# Altium project Altium PCB Template.PrjPCB
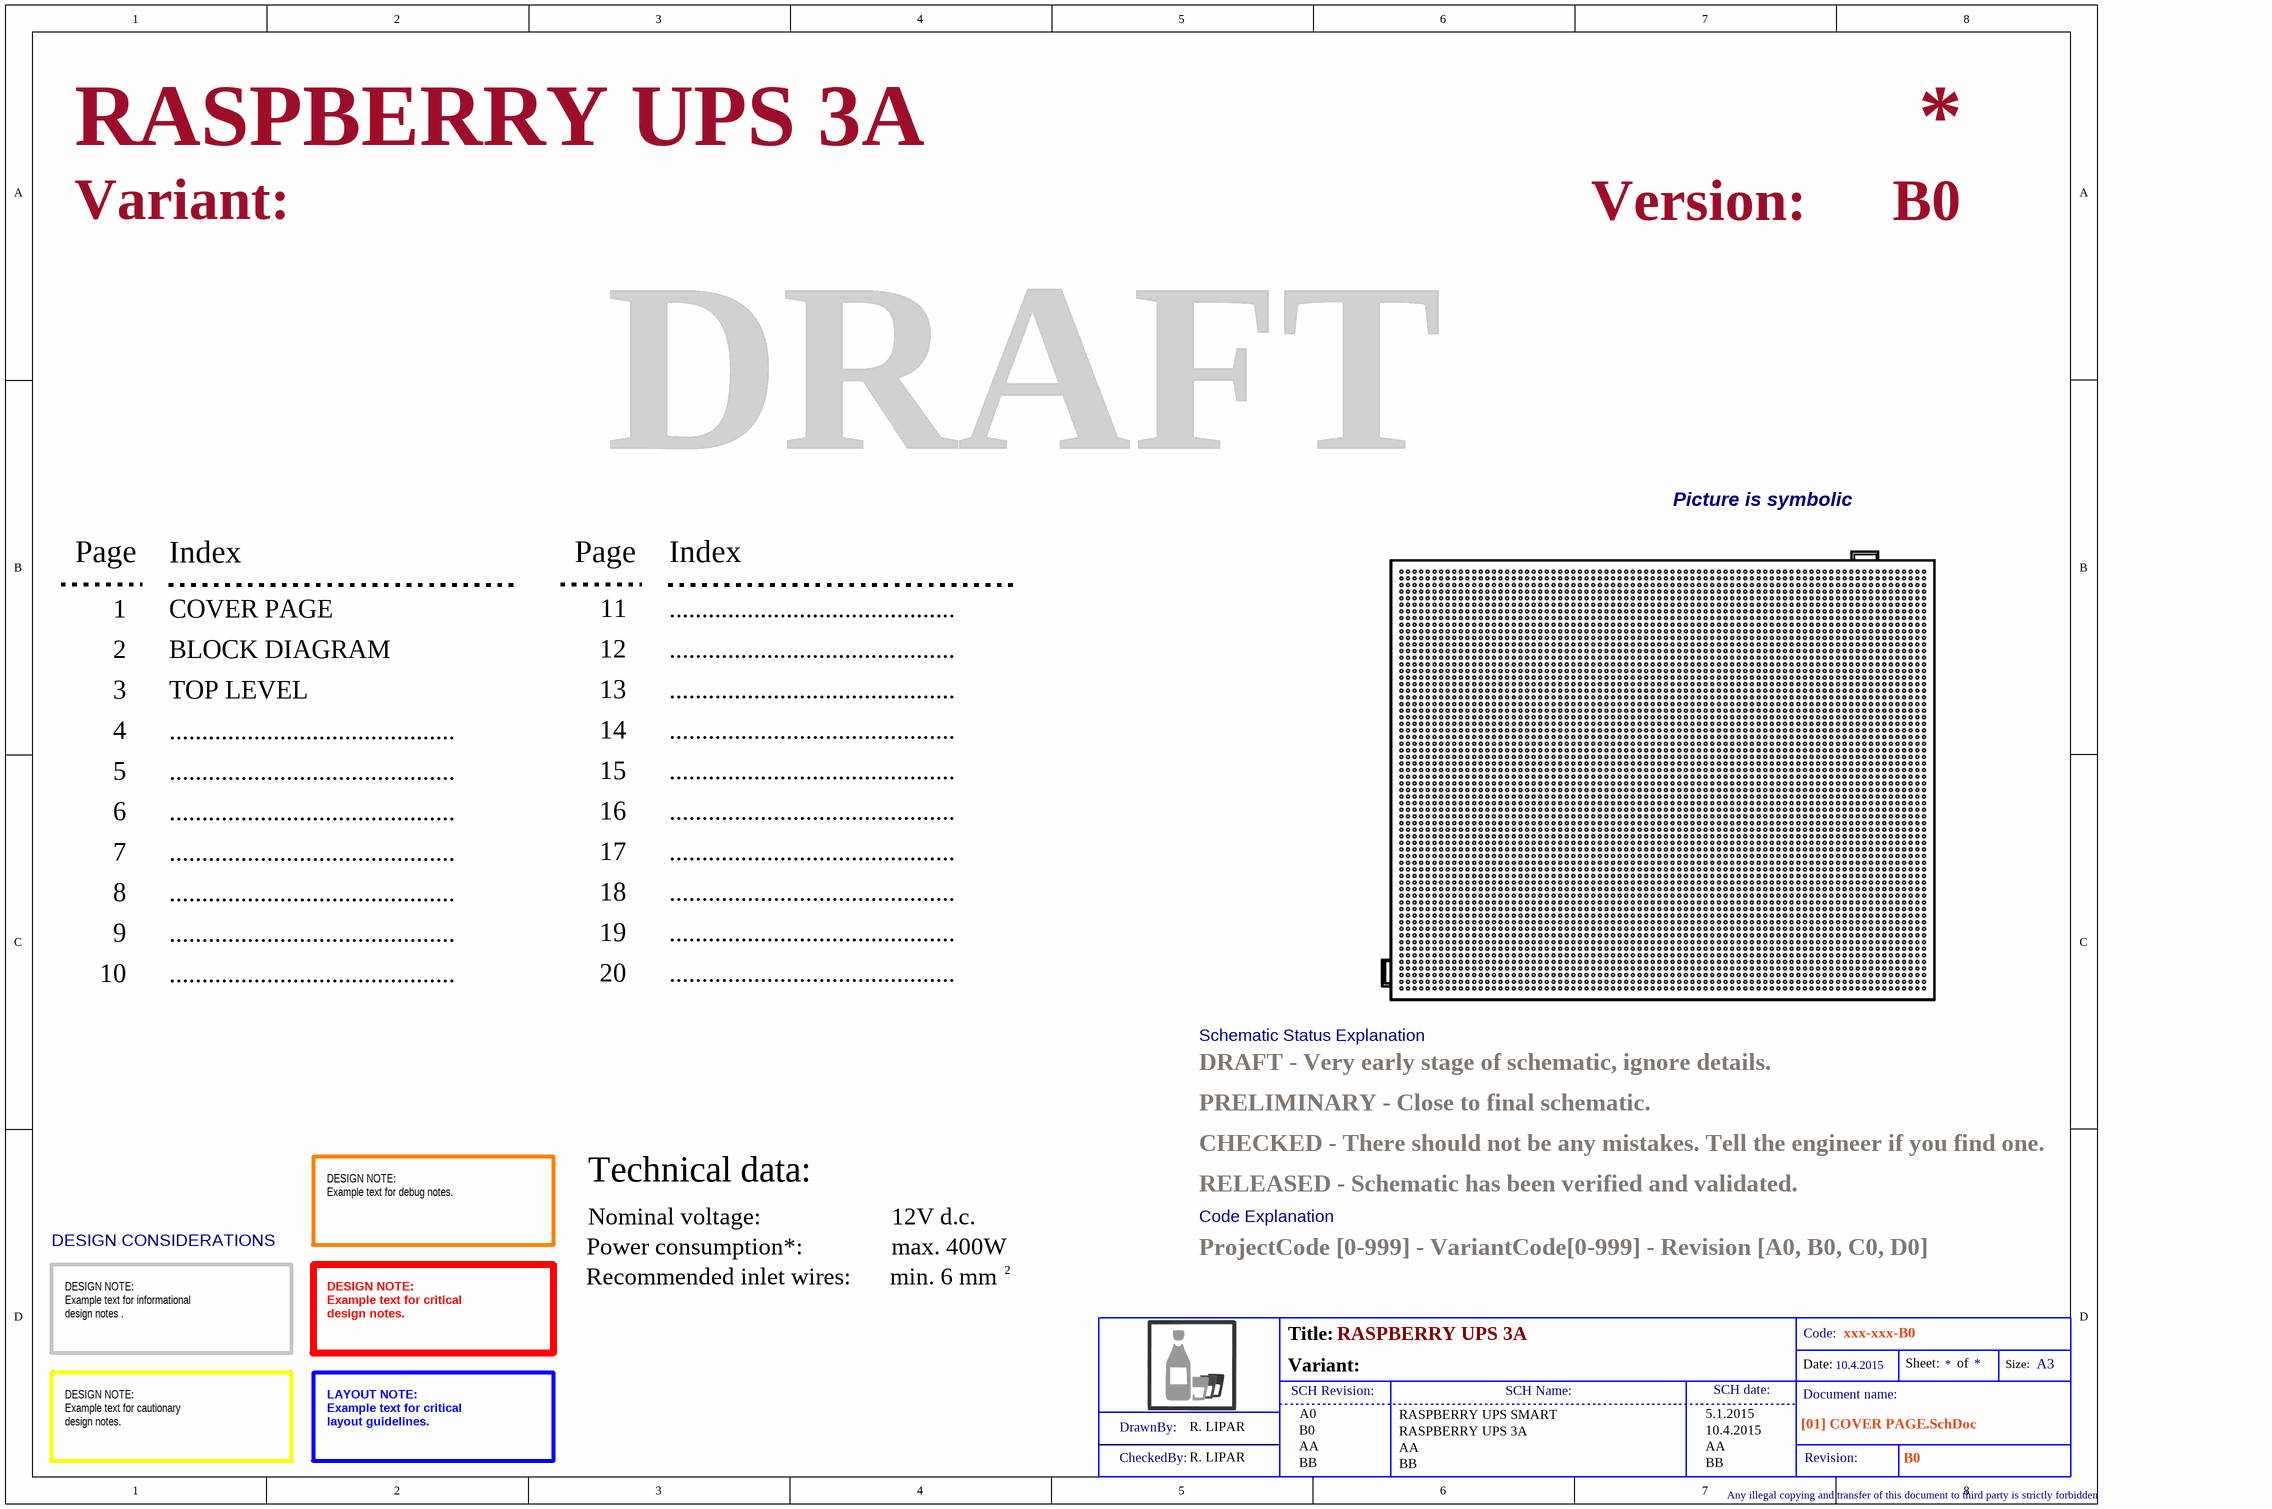
[diagram p0: [01] COVER PAGE.SchDoc]
SCHRevision: B0; SCHDate: 10.4.2015; SCHCode: xxx-xxx-B0; SCH3VERSION: BB; SCH3NAME: BB; SCH3DATE: BB; SCH2VERSION: AA; SCH2NAME: AA; SCH2DATE: AA; SCH1VERSION: B0; SCH1NAME: RASPBERRY UPS 3A; SCH1DATE: 10.4.2015; SCH0VERSION: A0; SCH0NAME: RASPBERRY UPS SMART; SCH0DATE: 5.1.2015; ProjectStatus: DRAFT; Project: RASPBERRY UPS 3A; PrjCheckBy: R. LIPAR; PrjAutor: R. LIPAR; PCBRevision: 001; CoverPage_20: ............................................; CoverPage_19: ............................................; CoverPage_18: ............................................; CoverPage_17: ............................................; CoverPage_16: ............................................; CoverPage_15: ............................................; CoverPage_14: ............................................; CoverPage_13: ............................................; CoverPage_12: ............................................; CoverPage_11: ............................................; CoverPage_10: ............................................; CoverPage_09: ............................................; CoverPage_08: ............................................; CoverPage_07: ............................................; CoverPage_06: ............................................; CoverPage_05: ............................................; CoverPage_04: ............................................; CoverPage_03: TOP LEVEL; CoverPage_02: BLOCK DIAGRAM; CoverPage_01: COVER PAGE
3 sheets, 11 parts. Net scope: global (net labels, ports and power ports of the same name join across sheets).
Board file: Template_Pcb_A3_Landscape_v1.PCBDOC
Sheets:
  [01] COVER PAGE.SchDoc
    TOP LEVEL = [03] TOP LEVEL.SchDoc
    TOP LEVEL = [02]BLOCK DIAGRAM.SchDoc

## Sheet [01] COVER PAGE.SchDoc
size A3; CheckedBy: R. LIPAR; Author: R. LIPAR; CompanyName: Pelinci; DrawnBy: R. LIPAR; Engineer: R. LIPAR; Organization: Pelinci; Address2: SI-4208 Sencur; Address3: Slovenia

### Sub-sheets
TOP LEVEL = [03] TOP LEVEL.SchDoc: no entries
TOP LEVEL = [02]BLOCK DIAGRAM.SchDoc: no entries

### Notes on the sheet
- Variant:
- Version:
- Picture is symbolic
- Page
- Index
- 1
- 11
- 2
- 3
- 12
- 13
- 4
- 5
- 14
- 15
- 6
- 16
- 7
- 8
- 17
- 18
- 9
- 10
- 19
- 20
- Schematic Status Explanation
- PRELIMINARY - Close to final schematic.
- DRAFT - Very early stage of schematic, ignore details.
- Technical data:
- RELEASED - Schematic has been verified and validated.
- CHECKED - There should not be any mistakes. Tell the engineer if you find one.
- DESIGN CONSIDERATIONS
- DESIGN NOTE:
  Example text for debug notes.
- Power consumption*:
- Nominal voltage:
- 12V d.c.
- max. 400W
- Code Explanation
- ProjectCode [0-999] - VariantCode[0-999] - Revision [A0, B0, C0, D0]
- Recommended inlet wires:
- min. 6 mm
- DESIGN NOTE:
  Example text for informational
  design notes .
- DESIGN NOTE:
  Example text for critical
  design notes.
- DESIGN NOTE:
  Example text for cautionary
  design notes.
- LAYOUT NOTE:
  Example text for critical
  layout guidelines.
- Title:
- SCH Revision:
- SCH Name:
- SCH date:
- Date:
- Code:
- Sheet:
- of
- Size:
- A3
- DrawnBy:
- CheckedBy:
- Document name:
- Revision:
- Any illegal copying and transfer of this document to third party is strictly forbidden

## Sheet [03] TOP LEVEL.SchDoc
size A3; CheckedBy: R. LIPAR; Author: R. LIPAR; CompanyName: Pelinci; DrawnBy: R. LIPAR; Engineer: R. LIPAR; Organization: Pelinci; Address2: SI-4208 Sencur; Address3: Slovenia
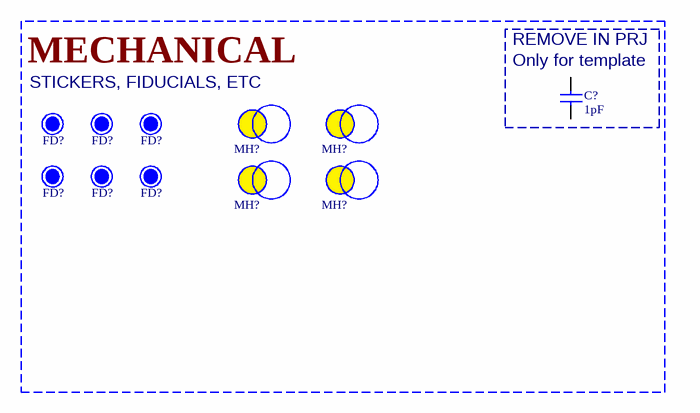
[diagram p1: [03] TOP LEVEL.SchDoc]

### Parts
(Parts that share a designator on the sheet are numbered #1, #2 ... from top to bottom, then left to right.)
C?  value 1pF  [CAP 0402-R1]  (hidden comment: CAP 1pF 50V NP0 0402)
FD?#1  FIDUCIAL O  [FIDUCIAL-FUTURIT]  (value not drawn)  (no BOM)
FD?#2  FIDUCIAL O  [FIDUCIAL-FUTURIT]  (value not drawn)  (no BOM)
FD?#3  FIDUCIAL O  [FIDUCIAL-FUTURIT]  (value not drawn)  (no BOM)
FD?#4  FIDUCIAL O  [FIDUCIAL-FUTURIT]  (value not drawn)  (no BOM)
FD?#5  FIDUCIAL O  [FIDUCIAL-FUTURIT]  (value not drawn)  (no BOM)
FD?#6  FIDUCIAL O  [FIDUCIAL-FUTURIT]  (value not drawn)  (no BOM)
MH?#1  Hole_3mm  [Hole_3mm]  (value not drawn)
MH?#2  Hole_3mm  [Hole_3mm]  (value not drawn)
MH?#3  Hole_3mm  [Hole_3mm]  (value not drawn)
MH?#4  Hole_3mm  [Hole_3mm]  (value not drawn)

### Nets

Not connected (* = marked no-connect by the designer): C? 1 2

### Notes on the sheet
- (near FD?#1) STICKERS, FIDUCIALS, ETC
- (near FD?#2) MECHANICAL
- (near C?) REMOVE IN PRJ
- (near C?) Only for template
- Variant:
- Title:
- SCH Revision:
- SCH Name:
- SCH date:
- Date:
- Code:
- Sheet:
- of
- Size:
- A3
- DrawnBy:
- CheckedBy:
- Document name:
- Revision:
- Any illegal copying and transfer of this document to third party is strictly forbidden

### Library data of the parts
C? = CAP 1pF 50V NP0 0402: CAP CEC 1pF 50V +/-0.1pF 0402; Component_ID: 205500046000; DC Bias: NO; Part ID: 14650; Type: NPO 0402; ComponentLink1Description: Datasheet; ComponentLink1URL: \\RNDPD01\CAE\DATASHEET\CAP\Murata CCM capacitors.pdf; Voltage: 50V; ComponentLink4Description: Datasheet - DC Bias; ComponentLink9Description: PRF; ComponentLink9URL: \\rndpd01\CAE\Part_Request\205500046000.pdf

## Sheet [02]BLOCK DIAGRAM.SchDoc
size A3; CheckedBy: R. LIPAR; Author: R. LIPAR; CompanyName: Pelinci; DrawnBy: R. LIPAR; Engineer: R. LIPAR; Organization: Pelinci; Address2: SI-4208 Sencur; Address3: Slovenia

### Notes on the sheet
- Variant:
- Title:
- SCH Revision:
- SCH Name:
- SCH date:
- Date:
- Code:
- Sheet:
- of
- Size:
- A3
- DrawnBy:
- CheckedBy:
- Document name:
- Revision:
- Any illegal copying and transfer of this document to third party is strictly forbidden

## Assembly variants
VariantName: all parts fitted